# Altium schematic sheet MCU.SchDoc
size A4; SheetNumber: 3; SheetTotal: 6
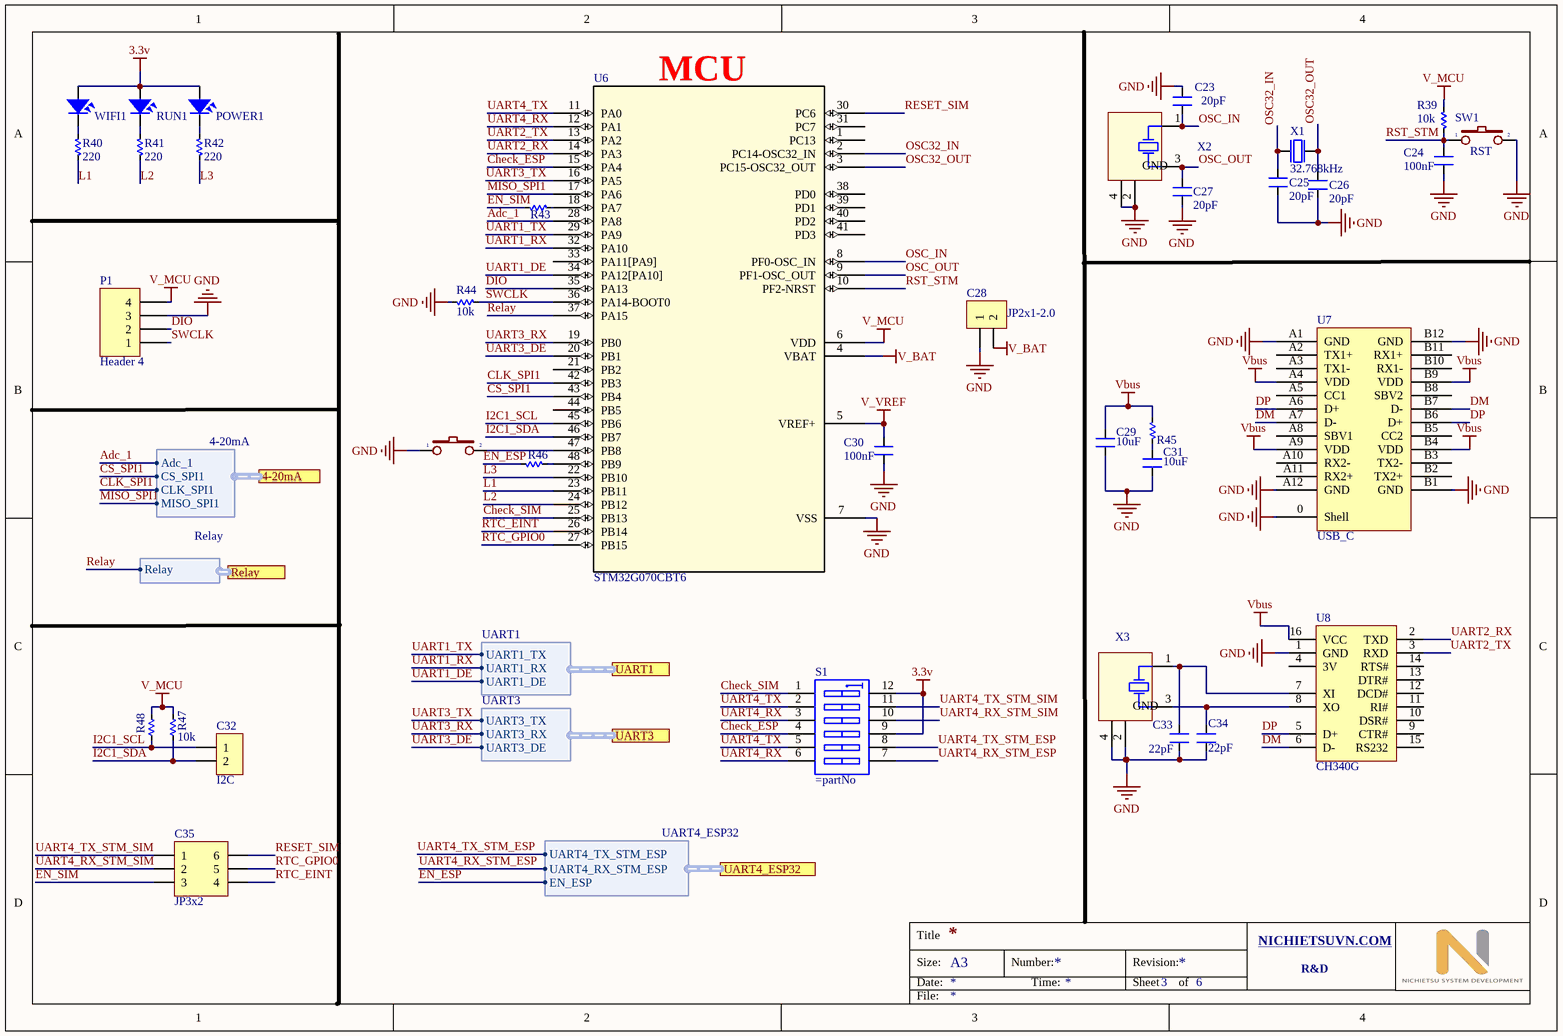
[diagram p0: MCU.SchDoc]

## Parts
C23  20pF  [CN-SMD-0603]
C24  100nF  [CN-SMD-0603]
C25  20pF  [CN-SMD-0603]
C26  20pF  [CN-SMD-0603]
C27  20pF  [CN-SMD-0603]
C28  JP2x1-2.0  [J2-C1T]
C29  10uF  [CN-SMD-0603]
C30  100nF  [CN-SMD-0603]
C31  10uF  [CN-SMD-0603]
C32  I2C  [J2-D1T]
C33  22pF  [CN-SMD-0603]
C34  22pF  [CN-SMD-0603]
C35  JP3x2  [JP3-C2T]
P1  Header 4  [Header 4]
POWER1  LED DO SMD  [LED-3MM-RED]  (value not drawn)
R39  10k  [RES-SMD-0603]
R40  220  [RES-SMD-0603]
R41  220  [RES-SMD-0603]
R42  220  [RES-SMD-0603]
R43  10k  [RES-SMD-0603]  (value not drawn)
R44  10k  [RES-SMD-0603]
R45  2R  [RES-SMD-0603]  (value not drawn)
R46  1K  [RES-SMD-0603]  (value not drawn)
R47  10k  [RES-SMD-0603]
R48  10k  [RES-SMD-0603]  (value not drawn)
RUN1  LED VANG SMD  [LED-3MM-BLUE]  (value not drawn)
S1  (no value)  [SW-DIP6]
SW1  RST  [SW1-SMD]
SW2  SW RESET  [SW1-DIP]  (value not drawn)
U6  STM32G070CBT6  [STM32G070CBT6]
U7  USB_C  [USB-Type_C_male]
U8  CH340G  [SO16]
WIFI1  LED XANH SMD  [LED-3MM-GREEN]  (value not drawn)
X1  32.768kHz  [XTAL_3215]
X2  XT4  [XT4-16.000MHz-4_V]  (value not drawn)
X3  XT4  [XT4-16.000MHz-4_V]  (value not drawn)

## Ports
4-20mA (harness 4-20mA), Relay (harness Relay), UART1 (harness UART1), UART3 (harness UART3), UART4_ESP32 (harness UART4_ESP32)

## Harnesses
UART1: UART1_TX, UART1_RX, UART1_DE
UART3: UART3_TX, UART3_RX, UART3_DE
Relay: Relay
UART4_ESP32: UART4_TX_STM_ESP, UART4_RX_STM_ESP, EN_ESP
4-20mA: Adc_1, CS_SPI1, CLK_SPI1, MISO_SPI1

## Nets
3.3v: POWER1.1 RUN1.1 S1.9 S1.12 WIFI1.1
GND: C23.2 C24.2 C25.1 C26.1 C27.1 C28.1 C29.1 C30.2 C31.1 C33.1 C34.1 P1.3 R44.2 SW1.2 SW2.1 U6.7(VSS) U7.0(Shell) U7.A1(GND) U7.A12(GND) U7.B1(GND) U7.B12(GND) U8.1(GND) X2.2(GND) X2.4(GND) X3.2(GND) X3.4(GND)
V_BAT: C28.2 U6.4(VBAT)
V_MCU: P1.4 R39.1 R47.2 R48.2 U6.6(VDD)
V_VREF: C30.1 U6.5(VREF+)
Vbus: C29.2 R45.2 U7.A4(VDD) U7.A9(VDD) U7.B4(VDD) U7.B9(VDD) U8.16(VCC)
Adc_1: U6.28(PA8) ; port 4-20mA.Adc_1
Check_ESP: S1.4 U6.15(PA4)
Check_SIM: S1.1 U6.25(PB13)
CLK_SPI1: U6.42(PB3) ; port 4-20mA.CLK_SPI1
CS_SPI1: U6.43(PB4) ; port 4-20mA.CS_SPI1
DIO: P1.2 U6.35(PA13)
DM: U7.A7(D-) U7.B7(D-) U8.6(D-)
DP: U7.A6(D+) U7.B6(D+) U8.5(D+)
EN_ESP: R46.2 ; port UART4_ESP32.EN_ESP
EN_SIM: C35.3 R43.2
I2C1_SCL: C32.1 R48.1 U6.45(PB6)
I2C1_SDA: C32.2 R47.1 U6.46(PB7)
L1: R40.2 U6.23(PB11)
L2: R41.2 U6.24(PB12)
L3: R42.2 U6.22(PB10)
MISO_SPI1: U6.17(PA6) ; port 4-20mA.MISO_SPI1
OSC32_IN: C25.2 U6.2(PC14-OSC32_IN) X1.2(out)
OSC32_OUT: C26.2 U6.3(PC15-OSC32_OUT) X1.1(inp)
OSC_IN: C23.1 U6.8(PF0-OSC_IN) X2.1(XTAL)
OSC_OUT: C27.2 U6.9(PF1-OSC_OUT) X2.3(XTAL)
Relay: U6.37(PA15) ; port Relay.Relay
RESET_SIM: C35.6 U6.30(PC6)
RST_STM: C24.1 R39.2 SW1.1 U6.10(PF2-NRST)
RTC_EINT: C35.4 U6.26(PB14)
RTC_GPIO0: C35.5 U6.27(PB15)
SWCLK: P1.1 R44.1 U6.36(PA14-BOOT0)
UART1_DE: U6.34(PA12[PA10]) ; port UART1.UART1_DE
UART1_RX: U6.32(PA10) ; port UART1.UART1_RX
UART1_TX: U6.29(PA9) ; port UART1.UART1_TX
UART2_RX: U6.14(PA3) U8.2(TXD)
UART2_TX: U6.13(PA2) U8.3(RXD)
UART3_DE: U6.20(PB1) ; port UART3.UART3_DE
UART3_RX: U6.19(PB0) ; port UART3.UART3_RX
UART3_TX: U6.16(PA5) ; port UART3.UART3_TX
UART4_RX: S1.3 S1.6 U6.12(PA1)
UART4_RX_STM_ESP: S1.7 ; port UART4_ESP32.UART4_RX_STM_ESP
UART4_RX_STM_SIM: C35.2 S1.10
UART4_TX: S1.2 S1.5 U6.11(PA0)
UART4_TX_STM_ESP: S1.8 ; port UART4_ESP32.UART4_TX_STM_ESP
UART4_TX_STM_SIM: C35.1 S1.11
NetC31_2: C31.2 R45.1
NetC33_2: C33.2 U8.7(XI) X3.1(XTAL)
NetC34_2: C34.2 U8.8(XO) X3.3(XTAL)
NetPOWER1_2: POWER1.2 R42.1
NetR40_1: R40.1 WIFI1.2
NetR41_1: R41.1 RUN1.2
NetR43_1: R43.1 U6.18(PA7)
NetR46_1: R46.1 U6.48(PB9)
NetSW2_2: SW2.2 U6.47(PB8)

Not connected (* = marked no-connect by the designer): U6 1(PC13) 21(PB2) 31(PC7) 33(PA11[PA9]) 38(PD0) 39(PD1) 40(PD2) 41(PD3) 44(PB5); U7 A2(TX1+) A3(TX1-) A5(CC1) A8(SBV1) A10(RX2-) A11(RX2+) B2(TX2+) B3(TX2-) B5(CC2) B8(SBV2) B10(RX1-) B11(RX1+); U8 4(3V) 9(CTR#) 10(DSR#) 11(RI#) 12(DCD#) 13(DTR#) 14(RTS#) 15(RS232)

## Notes on the sheet
- (near U6) MCU
- Title
- Size:
- Date:
- A3
- Number:
- Time:
- Revision:
- Sheet
- of
- NICHIETSUVN.COM <http://NICHIETSUVN.COM>
- R&D
- File:

## Library data of the parts
C23-C27 C29-C31 C33 C34 = CN: Value: 33pF
C28 C32 = JP2x1-2.0: WR-PHD 2.00 mm Socket Header; Manufacturer: W¨¹rth Elektronik eiSos GmbH; partNo: 62000211821; ComponentLink1 Description: Manufacturer; ComponentLink2 Description: Datasheet; NoPins: 02; Created Date: 2 April 2013; ComponentLink1URL: http://www.we-online.com; ComponentLink2URL: http://katalog.we-online.de/em/datasheet/6200xx11821.pdf; Created by: Karrer Zheng
C35 = JP3x2: WR-PHD 2.54 mm Dual Socket Header; Manufacturer: W¨¹rth Elektronik eiSos GmbH; partNo: 61300621821; ComponentLink1 Description: Manufacturer; ComponentLink2 Description: Datasheet; NoPins: 06; Created Date: 29 March 2013; ComponentLink1URL: http://www.we-online.com; ComponentLink2URL: http://katalog.we-online.de/em/datasheet/6130xx21821.pdf; Created by: Karrer Zheng
P1 = Header 4: Header, 4-Pin; LatestRevisionDate: 17-Jul-2002; LatestRevisionNote: Re-released for DXP Platform.; Publisher: Altium Limited
POWER1 RUN1 WIFI1 = LED: LED Single colour Green and Red; Value: LED 3 ly Single Colour
R39-R48 = Res-SMD: Resistor; Manufacturer: Generic Components; Class: Passive; Published: 08/06/2000; Publisher: Altium Hobart Technology Centre
S1 = SWDIP6: WS-DITV 2.54 mm small compact THT flat actuator with top tape; Manufacturer: Wurth Elektronik; Part No.: 418127160906; ComponentLink1 Description: Manufacturer; ComponentLink2 Description: Datasheet; Pole: 06; Created Date: Dec.2015; ComponentLink1URL: http://www.we-online.com; ComponentLink2URL: http://katalog.we-online.de/em/datasheet/4181271609xx.pdf; Created by: Baojun Chen
SW1 SW2 = SW2: Switch button 2 pin; Value: SW chip 2 pin
U6 = STM32G070CBT6: No Description Available; Vendor: STMicroelectronics; Built_By: EMA_UL_Team; SourceLibrary: Updates_to_database_2020-10-19; Manufacturer_Part_Number: STM32G070CBT6; Copyright: Copyright (C) 2018 Accelerated Designs. All rights reserved; RefDes: RefDes; Type: DEV
U8 = CH340G: High and Low Side Driver; Note: Pins 4, 8 and 14 are not connected; Published: 8-Jun-2000; LatestRevisionDate: 04-Mar-2005; LatestRevisionNote: Stylized 3D Model Added.; DatasheetVersion: PD60147J; PackageReference: PDIP14; Publisher: Altium Limited; PackageDescription: DIP; 14 Leads; Row Spacing 7.62 mm; Pitch 2.54 mm; ComponentLink1Description: Manufacturer Link; ComponentLink1URL: http://www.irf.com/; ComponentLink2Description: Datasheet; ComponentLink2URL: http://www.irf.com/product-info/datasheets/data/ir2110.pdf
X1 = XTAL_SMD3215: XTAL SMD 3215, 32.768kHz, Cl=9pF, Total Tol: ±50ppm; Part Number: XTAL_SMD3215_32.768kHz_9pF_General; Manufacturer: *; Manufacturer Part Number: *; LatestRevisionDate: 2016-08-19; Pin Count: 2; Publisher: Nordic Semiconductor; Published: 2016-08-19; Value: 32.768kHz; Footprint Doc: XTAL_3215
X2 X3 = XT4: Crystal, 16 MHz, -30 to 85 degC, 3.2 x 2.5 x 0.9 mm SMD; Value: 4Mhz
U7 = USB_C: ComponentLink1Description: Mouser; ComponentLink1URL: https://www.mouser.vn/ProductDetail/Molex/217179-0001?qs=%2Fha2pyFadujPZQwqJ4qpNy59rfbPKcIakI7RjWJ8vsrvMLBBzEB8wQ%3D%3D